# EAGLE schematic eclair-logical (EAGLE 6.6.0), part 2 of 2
## Sheet 9 of 10: Paging
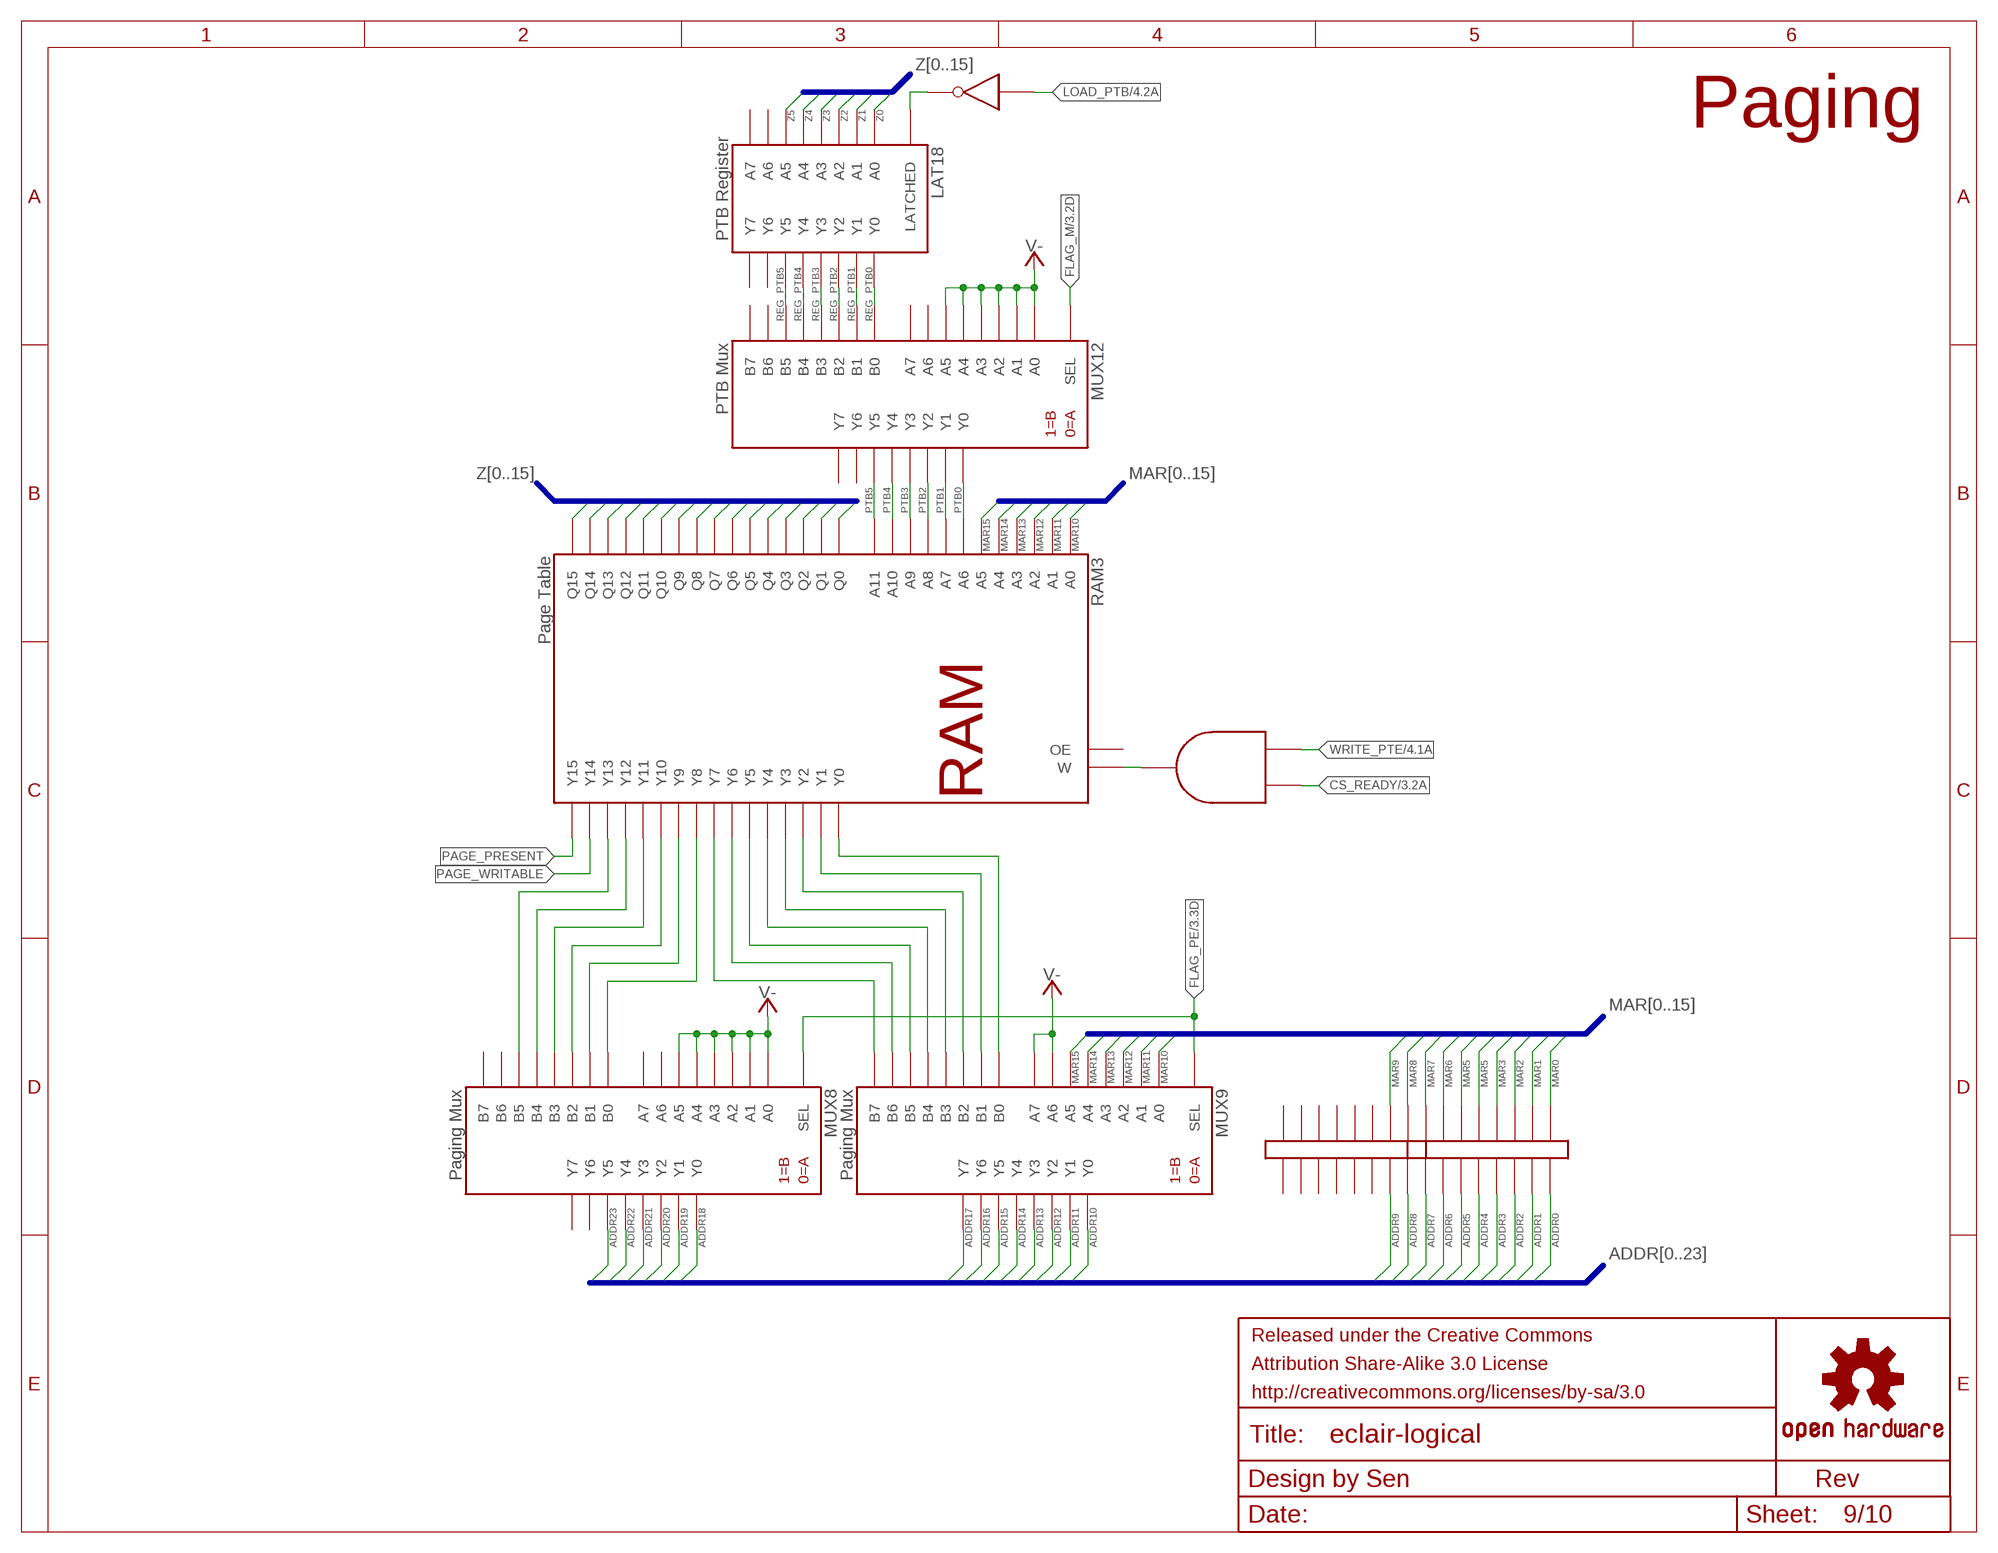
[diagram p8: schematic, sheet 9]

### Parts
AND10  AND-2  [NULL]
FRAME9  FRAME-LETTER-GRID-OSHW-SEN  [CC-BY-SA-3.0-LARGE]
LAT18  PTB Register  LATCH-8  [NULL]
LINK9  LINKS-8  [NULL]
LINK10  LINKS-8  [NULL]
MUX8  Paging Mux  MUX-2X8  [NULL]
MUX9  Paging Mux  MUX-2X8  [NULL]
MUX12  PTB Mux  MUX-2X8  [NULL]
NOT1  NOT  [NULL]
RAM3  Page Table  RAM-A12D16  [NULL]

### Nets
!LOAD_PID: LAT18.P$9(LATCHED) NOT1.P$2(Y)
ADDR0: LINK9.P$8(A8) ; also sheet 8
ADDR1: LINK9.P$7(A7) ; also sheet 8
ADDR2: LINK9.P$6(A6) ; also sheet 8
ADDR3: LINK9.P$5(A5) ; also sheet 8
ADDR4: LINK9.P$4(A4) ; also sheet 8
ADDR5: LINK9.P$3(A3) ; also sheet 8
ADDR6: LINK9.P$2(A2) ; also sheet 8
ADDR7: LINK9.P$1(A1) ; also sheet 8
ADDR8: LINK10.P$8(A8) ; also sheet 8
ADDR9: LINK10.P$7(A7) ; also sheet 8
ADDR10: MUX9.P$18(Y0) ; also sheet 8
ADDR11: MUX9.P$19(Y1) ; also sheet 8
ADDR12: MUX9.P$20(Y2) ; also sheet 8
ADDR13: MUX9.P$21(Y3) ; also sheet 8
ADDR14: MUX9.P$22(Y4) ; also sheet 8
ADDR15: MUX9.P$23(Y5) ; also sheet 8
ADDR16: MUX9.P$24(Y6) ; also sheet 8
ADDR17: MUX9.P$25(Y7) ; also sheet 8
ADDR18: MUX8.P$18(Y0) ; also sheet 8
ADDR19: MUX8.P$19(Y1) ; also sheet 8
ADDR20: MUX8.P$20(Y2) ; also sheet 8
ADDR21: MUX8.P$21(Y3) ; also sheet 8
ADDR22: MUX8.P$22(Y4) ; also sheet 8
ADDR23: MUX8.P$23(Y5) ; also sheet 8
CS_READY: AND10.P$1(A) ; also sheet 3,4,5
FLAG_M: MUX12.P$17(SEL) ; also sheet 3
FLAG_PE: MUX8.P$17(SEL) MUX9.P$17(SEL) ; also sheet 3
LOAD_PTB: NOT1.P$1(Q) ; also sheet 4
MAR0: LINK9.P$16(B8) ; also sheet 1,2
MAR1: LINK9.P$15(B7) ; also sheet 1,2
MAR2: LINK9.P$14(B6) ; also sheet 1,2
MAR3: LINK9.P$13(B5) ; also sheet 1,2
MAR5: LINK9.P$11(B3) LINK9.P$12(B4) ; also sheet 1,2
MAR6: LINK9.P$10(B2) ; also sheet 1,2
MAR7: LINK9.P$9(B1) ; also sheet 1,2
MAR8: LINK10.P$16(B8) ; also sheet 1,2
MAR9: LINK10.P$15(B7) ; also sheet 1,2
MAR10: MUX9.P$1(A0) RAM3.P$1(A0) ; also sheet 1,2
MAR11: MUX9.P$2(A1) RAM3.P$2(A1) ; also sheet 1,2
MAR12: MUX9.P$3(A2) RAM3.P$3(A2) ; also sheet 1,2
MAR13: MUX9.P$4(A3) RAM3.P$4(A3) ; also sheet 1,2
MAR14: MUX9.P$5(A4) RAM3.P$5(A4) ; also sheet 1,2
MAR15: MUX9.P$6(A5) RAM3.P$6(A5) ; also sheet 1,2
N$12: MUX8.P$12(B3) RAM3.P$42(Y11)
N$13: MUX8.P$13(B4) RAM3.P$43(Y12)
N$27: MUX8.P$14(B5) RAM3.P$44(Y13)
N$95: MUX8.P$10(B1) RAM3.P$40(Y9)
N$159: MUX8.P$11(B2) RAM3.P$41(Y10)
N$161: MUX9.P$15(B6) RAM3.P$37(Y6)
N$162: MUX9.P$16(B7) RAM3.P$38(Y7)
N$163: MUX9.P$9(B0) RAM3.P$31(Y0)
N$165: MUX9.P$10(B1) RAM3.P$32(Y1)
N$166: MUX9.P$11(B2) RAM3.P$33(Y2)
N$167: MUX9.P$12(B3) RAM3.P$34(Y3)
N$168: MUX9.P$13(B4) RAM3.P$35(Y4)
N$169: MUX9.P$14(B5) RAM3.P$36(Y5)
N$170: MUX8.P$9(B0) RAM3.P$39(Y8)
PAGE_PRESENT: RAM3.P$46(Y15)
PAGE_WRITABLE: RAM3.P$45(Y14)
PTB0: MUX12.P$18(Y0) RAM3.P$7(A6)
PTB1: MUX12.P$19(Y1) RAM3.P$8(A7)
PTB2: MUX12.P$20(Y2) RAM3.P$9(A8)
PTB3: MUX12.P$21(Y3) RAM3.P$10(A9)
PTB4: MUX12.P$22(Y4) RAM3.P$11(A10)
PTB5: MUX12.P$23(Y5) RAM3.P$12(A11)
REG_PTB0: LAT18.P$10(Y0) MUX12.P$9(B0)
REG_PTB1: LAT18.P$11(Y1) MUX12.P$10(B1)
REG_PTB2: LAT18.P$12(Y2) MUX12.P$11(B2)
REG_PTB3: LAT18.P$13(Y3) MUX12.P$12(B3)
REG_PTB4: LAT18.P$14(Y4) MUX12.P$13(B4)
REG_PTB5: LAT18.P$15(Y5) MUX12.P$14(B5)
V-: MUX8.P$1(A0) MUX8.P$2(A1) MUX8.P$3(A2) MUX8.P$4(A3) MUX8.P$5(A4) MUX8.P$6(A5) MUX9.P$7(A6) MUX9.P$8(A7) MUX12.P$1(A0) MUX12.P$2(A1) MUX12.P$3(A2) MUX12.P$4(A3) MUX12.P$5(A4) MUX12.P$6(A5) ; also sheet 2,5,10
WRITE_PTE: AND10.P$2(B) ; also sheet 4
WRITE_PTE_NOW: AND10.P$3(Y) RAM3.P$30(W)
Z0: LAT18.P$1(A0) RAM3.P$14(Q0) ; also sheet 1,2,3,6,10
Z1: LAT18.P$2(A1) RAM3.P$15(Q1) ; also sheet 1,2,3,6,10
Z2: LAT18.P$3(A2) RAM3.P$16(Q2) ; also sheet 1,2,3,6,10
Z3: LAT18.P$4(A3) RAM3.P$17(Q3) ; also sheet 1,2,3,6,10
Z4: LAT18.P$5(A4) RAM3.P$18(Q4) ; also sheet 1,2,3,6,10
Z5: LAT18.P$6(A5) RAM3.P$19(Q5) ; also sheet 1,2,3,6,10
Z6: RAM3.P$20(Q6) ; also sheet 1,2,3,6,10
Z7: RAM3.P$21(Q7) ; also sheet 1,2,3,6,10
Z8: RAM3.P$22(Q8) ; also sheet 1,2,3,6
Z9: RAM3.P$23(Q9) ; also sheet 1,2,3,6
Z10: RAM3.P$24(Q10) ; also sheet 1,2,3,6
Z11: RAM3.P$25(Q11) ; also sheet 1,2,3,6
Z12: RAM3.P$26(Q12) ; also sheet 1,2,3,6
Z13: RAM3.P$27(Q13) ; also sheet 1,2,3,6
Z14: RAM3.P$28(Q14) ; also sheet 1,2,3,6
Z15: RAM3.P$29(Q15) ; also sheet 1,2,3,6
Unconnected: LAT18.P$7(A6) LAT18.P$8(A7) LAT18.P$16(Y6) LAT18.P$17(Y7) LINK10.P$1(A1) LINK10.P$2(A2) LINK10.P$3(A3) LINK10.P$4(A4) LINK10.P$5(A5) LINK10.P$6(A6) LINK10.P$9(B1) LINK10.P$10(B2) LINK10.P$11(B3) LINK10.P$12(B4) LINK10.P$13(B5) LINK10.P$14(B6) MUX8.P$7(A6) MUX8.P$8(A7) MUX8.P$15(B6) MUX8.P$16(B7) MUX8.P$24(Y6) MUX8.P$25(Y7) MUX12.P$7(A6) MUX12.P$8(A7) MUX12.P$15(B6) MUX12.P$16(B7) MUX12.P$24(Y6) MUX12.P$25(Y7) RAM3.P$13(OE)

### Buses
MAR[0..15]
ADDR[0..23]
Z[0..15]

### Notes on the sheet
- Paging

## Sheet 10 of 10: Traps/Faults/Interrupts
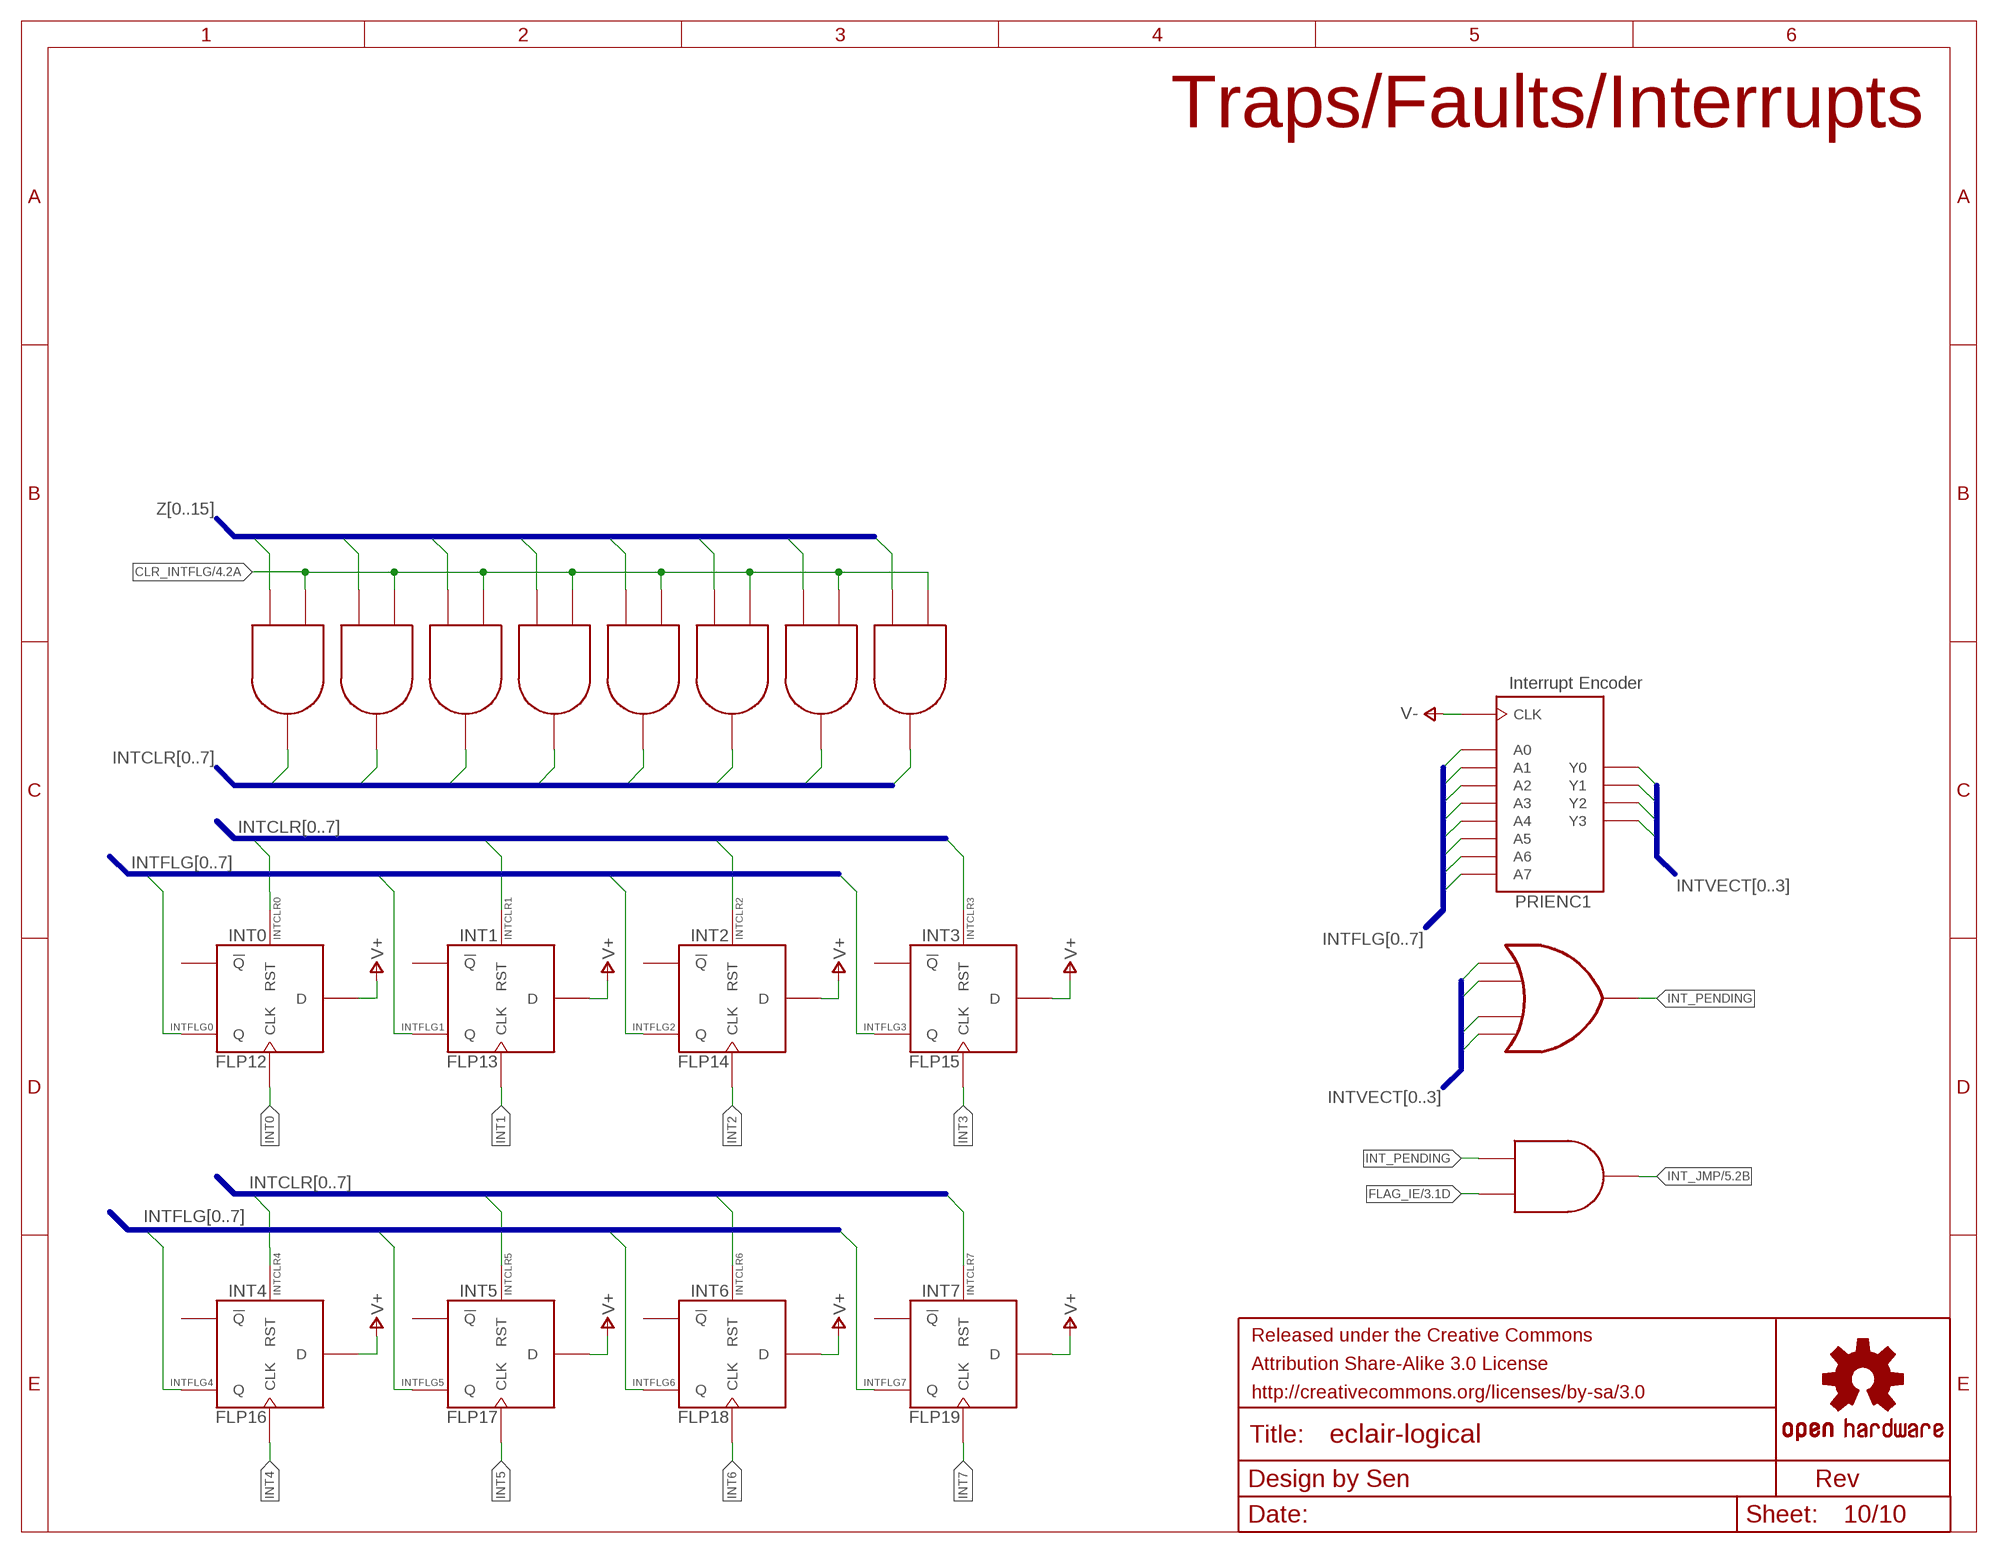
[diagram p9: schematic, sheet 10]

### Parts
AND12  AND-2  [NULL]
AND13  AND-2  [NULL]
AND14  AND-2  [NULL]
AND15  AND-2  [NULL]
AND16  AND-2  [NULL]
AND17  AND-2  [NULL]
AND18  AND-2  [NULL]
AND19  AND-2  [NULL]
AND22  AND-2  [NULL]
FLP12  INT0  FLIPFLOP-D-1  [NULL]
FLP13  INT1  FLIPFLOP-D-1  [NULL]
FLP14  INT2  FLIPFLOP-D-1  [NULL]
FLP15  INT3  FLIPFLOP-D-1  [NULL]
FLP16  INT4  FLIPFLOP-D-1  [NULL]
FLP17  INT5  FLIPFLOP-D-1  [NULL]
FLP18  INT6  FLIPFLOP-D-1  [NULL]
FLP19  INT7  FLIPFLOP-D-1  [NULL]
FRAME10  FRAME-LETTER-GRID-OSHW-SEN  [CC-BY-SA-3.0-LARGE]
OR9  OR-4  [NULL]
PRIENC1  Interrupt Encoder  PRIORITYENC-8  [NULL]

### Nets
CLR_INTFLG: AND12.P$1(A) AND13.P$1(A) AND14.P$1(A) AND15.P$1(A) AND16.P$1(A) AND17.P$1(A) AND18.P$1(A) AND19.P$1(A) ; also sheet 4
FLAG_IE: AND22.P$2(B) ; also sheet 3
INT0: FLP12.P$2(CLK)
INT1: FLP13.P$2(CLK)
INT2: FLP14.P$2(CLK)
INT3: FLP15.P$2(CLK)
INT4: FLP16.P$2(CLK)
INT5: FLP17.P$2(CLK)
INT6: FLP18.P$2(CLK)
INT7: FLP19.P$2(CLK)
INT_JMP: AND22.P$3(Y) ; also sheet 5
INT_PENDING: AND22.P$1(A) OR9.P$5(Y)
INTCLR0: AND12.P$3(Y) FLP12.P$5(RST)
INTCLR1: AND13.P$3(Y) FLP13.P$5(RST)
INTCLR2: AND14.P$3(Y) FLP14.P$5(RST)
INTCLR3: AND15.P$3(Y) FLP15.P$5(RST)
INTCLR4: AND16.P$3(Y) FLP16.P$5(RST)
INTCLR5: AND17.P$3(Y) FLP17.P$5(RST)
INTCLR6: AND18.P$3(Y) FLP18.P$5(RST)
INTCLR7: AND19.P$3(Y) FLP19.P$5(RST)
INTFLG0: FLP12.P$4(Q) PRIENC1.P$1(A0)
INTFLG1: FLP13.P$4(Q) PRIENC1.P$2(A1)
INTFLG2: FLP14.P$4(Q) PRIENC1.P$3(A2)
INTFLG3: FLP15.P$4(Q) PRIENC1.P$4(A3)
INTFLG4: FLP16.P$4(Q) PRIENC1.P$5(A4)
INTFLG5: FLP17.P$4(Q) PRIENC1.P$6(A5)
INTFLG6: FLP18.P$4(Q) PRIENC1.P$7(A6)
INTFLG7: FLP19.P$4(Q) PRIENC1.P$8(A7)
INTVECT0: OR9.P$1(A) PRIENC1.P$10(Y0) ; also sheet 2
INTVECT1: OR9.P$2(B) PRIENC1.P$11(Y1) ; also sheet 2
INTVECT2: OR9.P$3(C) PRIENC1.P$12(Y2) ; also sheet 2
INTVECT3: OR9.P$4(D) PRIENC1.P$13(Y3) ; also sheet 2
V+: FLP12.P$3(D) FLP13.P$3(D) FLP14.P$3(D) FLP15.P$3(D) FLP16.P$3(D) FLP17.P$3(D) FLP18.P$3(D) FLP19.P$3(D) ; also sheet 1,4,5,7
V-: PRIENC1.P$9(CLK) ; also sheet 2,5,9
Z0: AND12.P$2(B) ; also sheet 1,2,3,6,9
Z1: AND13.P$2(B) ; also sheet 1,2,3,6,9
Z2: AND14.P$2(B) ; also sheet 1,2,3,6,9
Z3: AND15.P$2(B) ; also sheet 1,2,3,6,9
Z4: AND16.P$2(B) ; also sheet 1,2,3,6,9
Z5: AND17.P$2(B) ; also sheet 1,2,3,6,9
Z6: AND18.P$2(B) ; also sheet 1,2,3,6,9
Z7: AND19.P$2(B) ; also sheet 1,2,3,6,9
Unconnected: FLP12.P$1(!Q) FLP13.P$1(!Q) FLP14.P$1(!Q) FLP15.P$1(!Q) FLP16.P$1(!Q) FLP17.P$1(!Q) FLP18.P$1(!Q) FLP19.P$1(!Q)

### Buses
INTFLG[0..7]
INTCLR[0..7]
Z[0..15]
INTVECT[0..3]

### Notes on the sheet
- Traps/Faults/Interrupts

## Library data of the parts
ALU1-ALU4 = logicalgates-sen:ALU-4
AND1 = logicalgates-sen:AND-4
AND2-AND24 = logicalgates-sen:AND-2: 2-input AND gate
CLAG1 = logicalgates-sen:CLAG-4
CTR1-CTR4 = logicalgates-sen:COUNTER-8-LR: 8-bit counter w/ set and reset
DEMUX1 DEMUX4 = logicalgates-sen:DEMUX-3X8: 3-in 8-out demultiplexer
DEMUX2 DEMUX3 = logicalgates-sen:DEMUX-8X8
DLY1 DLY2 = logicalgates-sen:DELAY
FLP1 FLP3-FLP10 = logicalgates-sen:FLIPFLOP-D
FLP2 = logicalgates-sen:FLIPFLOP-JK: Standard JK flip-flop
FLP12-FLP19 FLP21-FLP23 = logicalgates-sen:FLIPFLOP-D-1
FRAME1-FRAME10 = logos-sen:FRAME-LETTER-GRID-OSHW-SEN: Landscape letter-sized schematic frame w/ OSHW logo, edge grid; REV: 001
LAT1-LAT21 = logicalgates-sen:LATCH-8: 8-bit latch
LINK1-LINK10 = logicalgates-sen:LINKS-8: 8 "0-ohm" links, used to have signals with different names on either side.
MUX1 MUX2 MUX4-MUX10 MUX12 MUX14 MUX15 = logicalgates-sen:MUX-2X8: 2-input 8-bit mux
MUX3 = logicalgates-sen:MUX-2X1: 2-way 1-bit mux
MUX11 = logicalgates-sen:MUX-8X1
MUX13 = logicalgates-sen:MUX-2X4: 2-way 4-bit mux
NAND1 = logicalgates-sen:NAND-2
NOR1 NOR2 NOR7 = logicalgates-sen:NOR-2
NOR3-NOR6 = logicalgates-sen:NOR-4
NOT1-NOT3 = logicalgates-sen:NOT: Inverter
OR1-OR4 = logicalgates-sen:OR-2
OR5-OR9 = logicalgates-sen:OR-4
PRIENC1 = logicalgates-sen:PRIORITYENC-8: 8-input 4-output priority encoder w/ latch
RAM1 = logicalgates-sen:RAM-A8D64: 64-bit wide 256-word deep RAM
RAM2 = logicalgates-sen:RAM-A20D8
RAM3 = logicalgates-sen:RAM-A12D16: 16-bit wide 4096-word deep RAM
ROM1 = logicalgates-sen:ROM-A8D64: 64-bit wide 256-word deep ROM
ROM2 = logicalgates-sen:ROM-A20D8